# Altium project Project_.PrjPcb
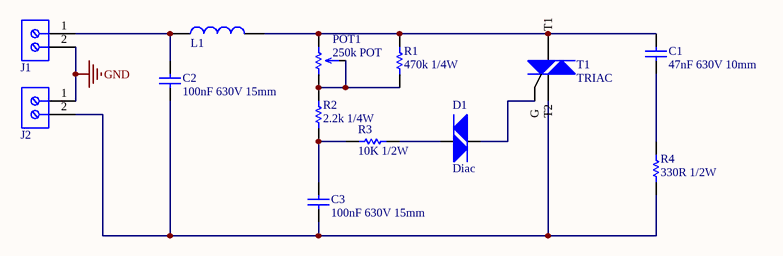
[diagram p0: Main.SchDoc]
1 sheet, 13 parts. Net scope: global (net labels, ports and power ports of the same name join across sheets).
Board file: Dimmer_PCB.PcbDoc

## Sheet Main.SchDoc
size A4; SheetNumber: 1; SheetTotal: 1

### Parts
C1  47nF 630V 10mm  [10mm_CAP]
C2  100nF 630V 15mm  [15mm_cap]
C3  100nF 630V 15mm  [15mm_cap]
D1  Diac  [DB3]
J1  691103110002  [691103110002]  (value not drawn)
J2  691103110002  [691103110002]  (value not drawn)
L1  90µH  [7447013]  (value not drawn)
POT1  250k POT  [Potentiometers]
R1  470k 1/4W  [1/4W axial]
R2  2.2k 1/4W  [1/4W axial]
R3  10K 1/2W  [1/4W axial]
R4  330R 1/2W  [1/2 axial]
T1  TRIAC  [TO-220]

### Nets
GND: J1.2 J2.1
NetC1_1: C1.1 R4.1
NetC1_2: C1.2 L1.2 POT1.1 R1.1 T1.1(T1)
NetC2_1: C2.1 C3.1 J2.2 R4.2 T1.2(T2)
NetC2_2: C2.2 J1.1 L1.1
NetC3_2: C3.2 R2.2 R3.2
NetD1_1: D1.1 R3.1
NetD1_2: D1.2 T1.3(G)
NetPOT1_2: POT1.2 POT1.3 R1.2 R2.1

### Library data of the parts
C1 = 47nF 630V 10mm: CAP.POL.47nF 630VDC 10MM 10% MKT FARATRONIC; value: 47nF 630V 10mm
C2 C3 = 100nF 630V 15mm: CAP.POL.100nF 630VDC 15MM 10% MKP DAMLA BULK FARAT; value: 100nF 630V 15mm
D1 = DB3: Diac/Sidac Thyristor 30 ~ 34V DO-35; MF: STMicroelectronics; MP: DB3TG; Package: DO-35 STMicroelectronics; Price: None; Check_prices: https://www.snapeda.com/parts/DB3TG/STMicroelectronics/view-part/?ref=eda; Value: Diac; SnapEDA_Link: https://www.snapeda.com/parts/DB3TG/STMicroelectronics/view-part/?ref=snap; Availability: In Stock; Purchase-URL: https://pricing.snapeda.com/search/part/DB3TG/?ref=eda
J1 J2 = 691103110002: WR-TBL Series 1031 Horizontal Entry Modular, THT, pitch 3.5mm, 2p; Manufacturer: Wurth Elektronik; Modularity: Yes; Rated Current: 10A; Working Voltage: 125V; Manufacturer Part Number: 691103110002; Category: Terminal Blocks; Match Code: WR-TBL; ComponentLink1Description: Website Link; ComponentLink1URL: https://www.we-online.com/redexpert/article/691103110002?ad; ComponentLink2Description: Datasheet Link; ComponentLink2URL: https://www.we-online.com/redexpert/spec/691103110002?ad; Mount: Through Hole; Operating Temperature Max: 105°C; Operating Temperature Min: -40°C; Packaging: Box; Application: Pressure Clamp; Number of Pins: 2; Number of Rows: 1; Orientation: Horizontal; Pitch: 3.5mm
L1 = 90uH Toroidal Line Choke: WE-FI THT Leaded Toroidal Line Choke, 90µH, 4.6A, 0.04Ω; Manufacturer: Wurth Elektronik; Manufacturer Part Number: 7447013; Category: Filter Chokes; Match Code: WE-FI; ComponentLink1Description: Website Link; ComponentLink1URL: https://www.we-online.com/redexpert/article/7447013?ad; ComponentLink2Description: Datasheet Link; ComponentLink2URL: https://www.we-online.com/redexpert/spec/7447013?ad; Mount: Through Hole; Operating Temperature Max: 105°C; Operating Temperature Min: -40°C; Packaging: Tray; Length: 18.5mm; Width: 10.5mm; Height: 18.5mm; DC Resistance Max: 0.04Ω; Inductance: 90µH; Rated Current: 4.6A
POT1 = Potentiometer: POT 220K 0.125W 1 TURN CARBON LINEAR ±20%; value: 250k POT
R1 = 470K 1/4W axial: 407 1/4W axial resistor; value: 470k 1/4W
R2 = 2.2K 1/24 axial: 2.2K axial resistor; value: 2.2k 1/4W
R3 = 10K 1/2W axial: 10K 1/4W resistor; value: 10K 1/2W
R4 = 330R 1/2W axial: value: 330R 1/2W
T1 = TRIAC: TRIAC Standard 800 V XA Through Hole TO-220AB; value: TRIAC